# EAGLE design domino-clock-r1 (EAGLE 5.11)
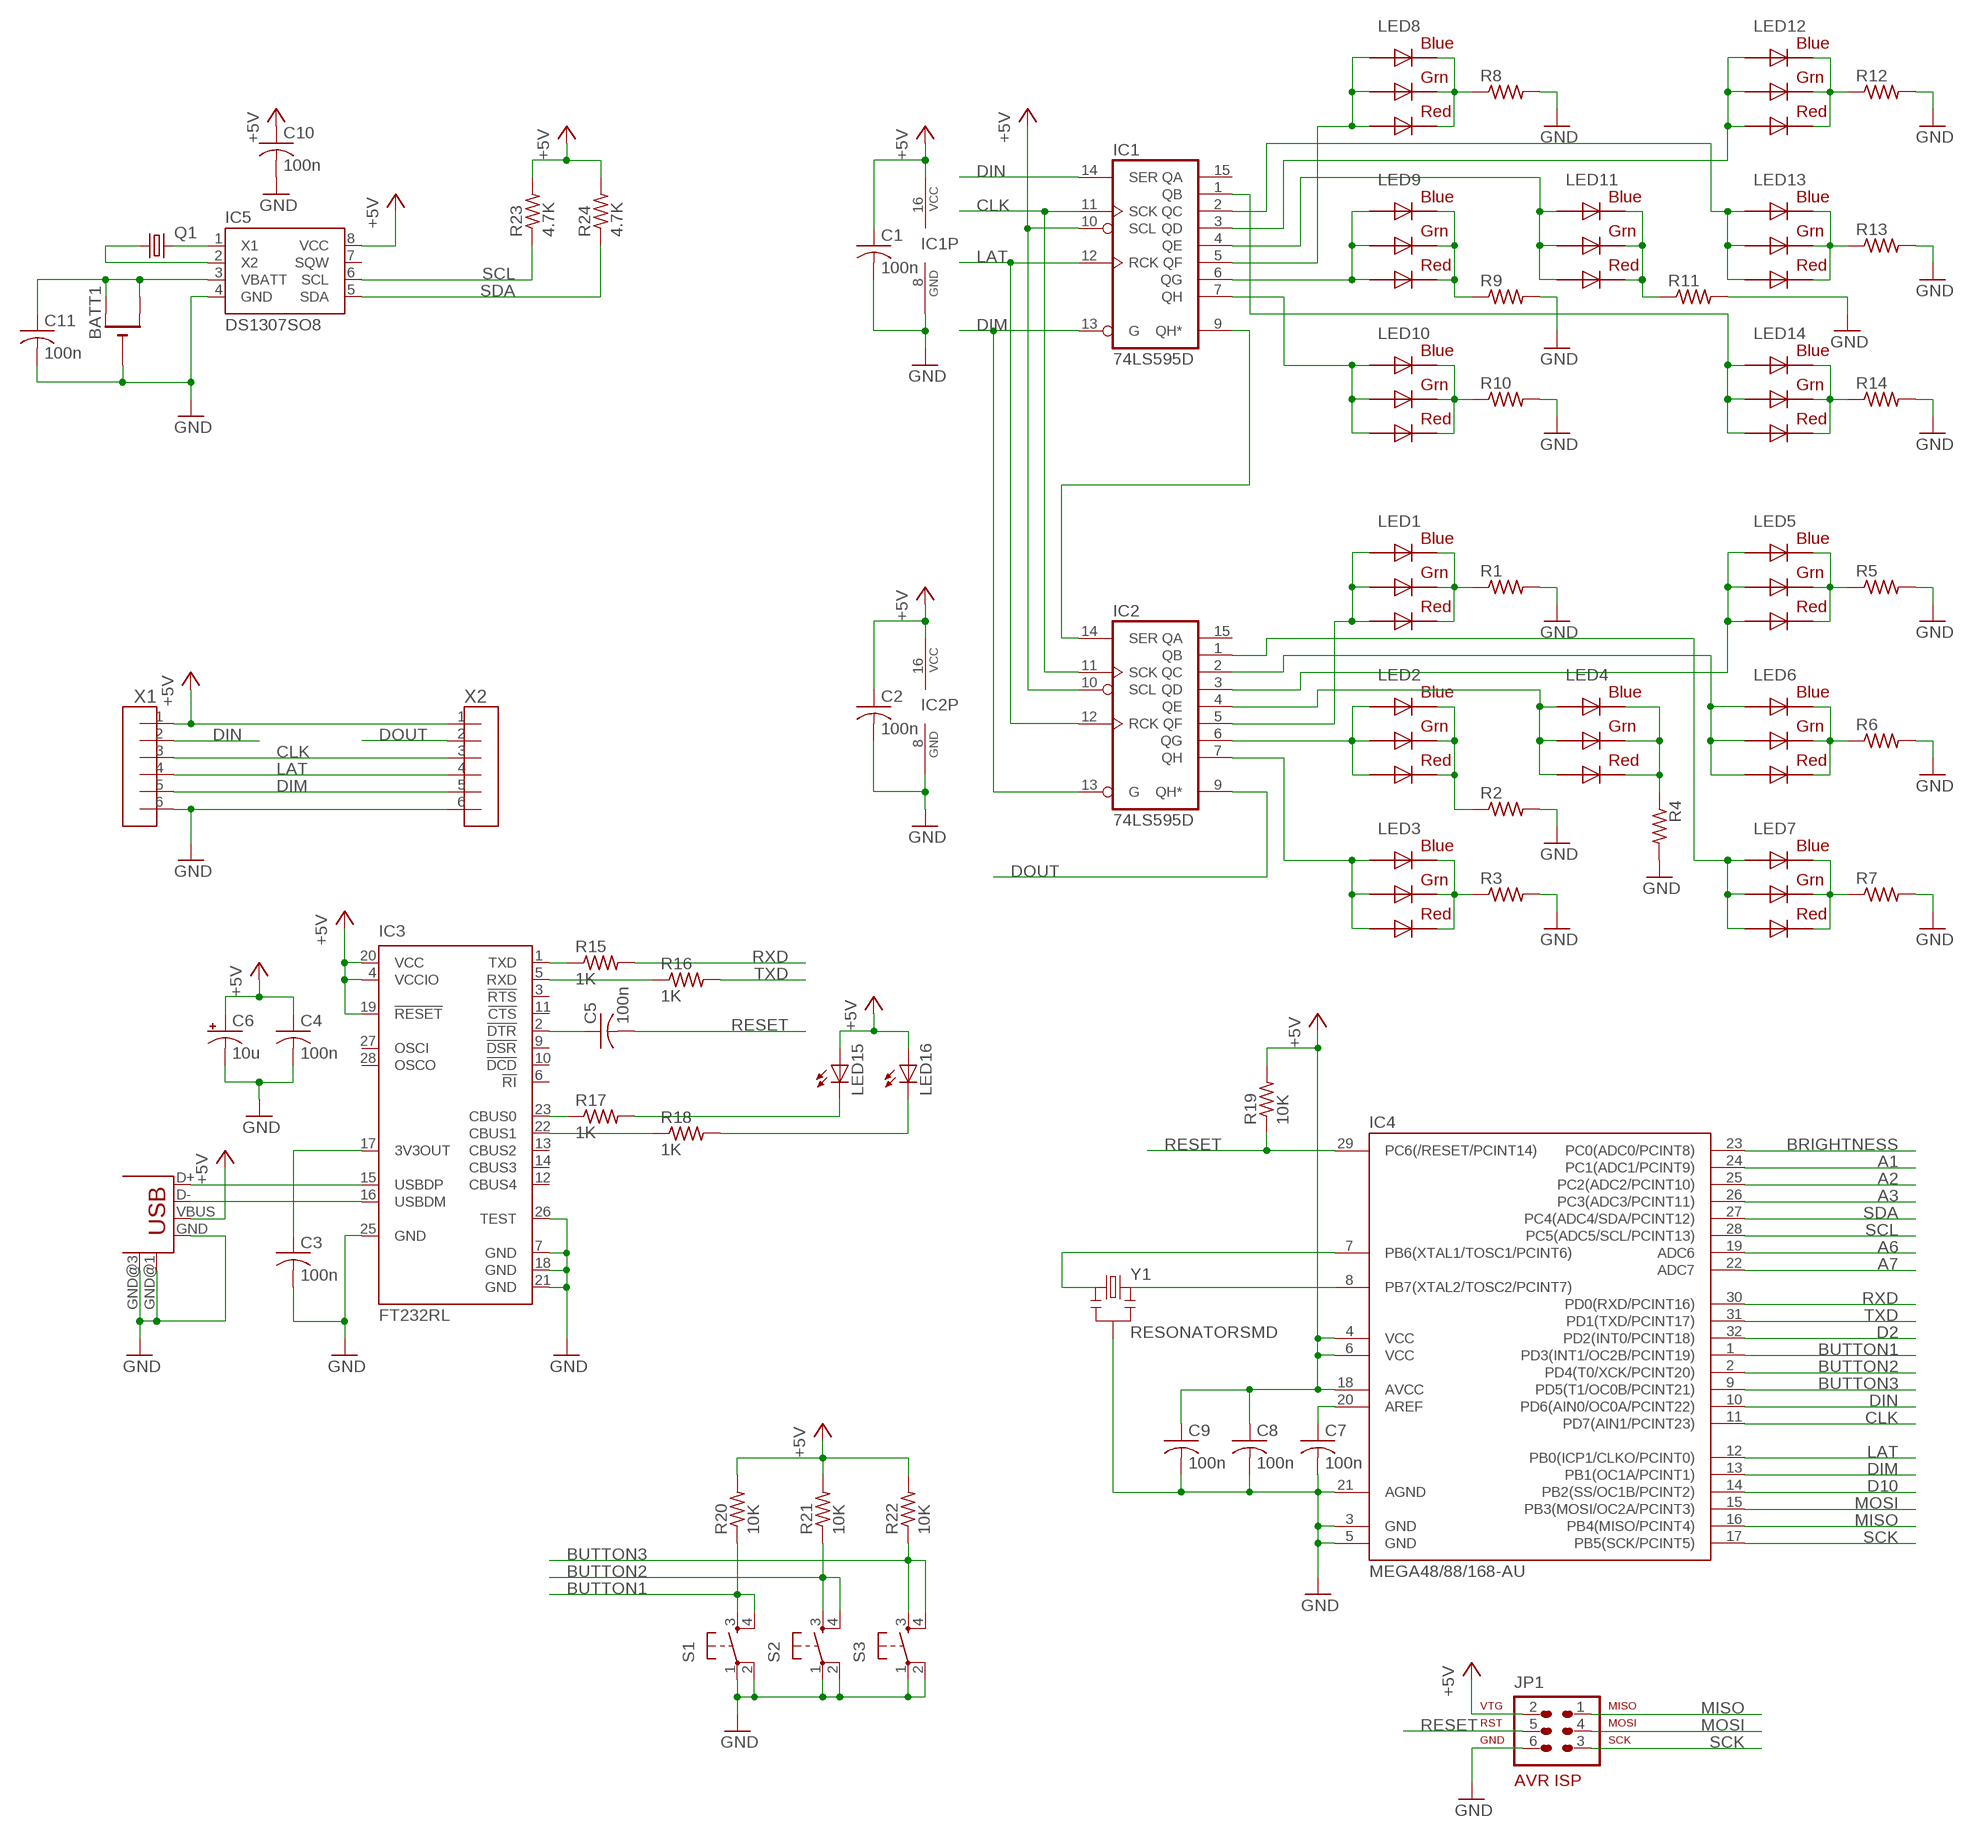
[diagram p0: schematic, sheet 1]

## Parts
BATT1  CR1220SMT  [CR1220-SMD]
C1  100n  C-USC0603  [C0603]
C2  100n  C-USC0603  [C0603]
C3  100n  C-USC0603  [C0603]
C4  100n  C-USC0603  [C0603]
C5  100n  C-USC0603  [C0603]
C6  10u  CPOL-USB  [PANASONIC_B]
C7  100n  C-USC0603  [C0603]
C8  100n  C-USC0603  [C0603]
C9  100n  C-USC0603  [C0603]
C10  100n  C-USC0603  [C0603]
C11  100n  C-USC0603  [C0603]
IC1  74LS595D  [SO16]
IC2  74LS595D  [SO16]
IC3  FT232RL  [SSOP28]
IC4  MEGA48/88/168-AU  [TQFP32-08]
IC5  DS1307SO8  [SO08]
JP1  AVR-ISP-6  [AVR-ISP-6]
LED1  RGBLED5050  [RGBLED5050]
LED2  RGBLED5050  [RGBLED5050]
LED3  RGBLED5050  [RGBLED5050]
LED4  RGBLED5050  [RGBLED5050]
LED5  RGBLED5050  [RGBLED5050]
LED6  RGBLED5050  [RGBLED5050]
LED7  RGBLED5050  [RGBLED5050]
LED8  RGBLED5050  [RGBLED5050]
LED9  RGBLED5050  [RGBLED5050]
LED10  RGBLED5050  [RGBLED5050]
LED11  RGBLED5050  [RGBLED5050]
LED12  RGBLED5050  [RGBLED5050]
LED13  RGBLED5050  [RGBLED5050]
LED14  RGBLED5050  [RGBLED5050]
LED15  LEDCHIP-LED0603  [CHIP-LED0603]
LED16  LEDCHIP-LED0603  [CHIP-LED0603]
Q1  CRYSTALTC38H  [TC38H]
R1  R-US_R0805  [R0805]
R2  R-US_R0805  [R0805]
R3  R-US_R0805  [R0805]
R4  R-US_R0805  [R0805]
R5  R-US_R0805  [R0805]
R6  R-US_R0805  [R0805]
R7  R-US_R0805  [R0805]
R8  R-US_R0805  [R0805]
R9  R-US_R0805  [R0805]
R10  R-US_R0805  [R0805]
R11  R-US_R0805  [R0805]
R12  R-US_R0805  [R0805]
R13  R-US_R0805  [R0805]
R14  R-US_R0805  [R0805]
R15  1K  R-US_R0603  [R0603]
R16  1K  R-US_R0603  [R0603]
R17  1K  R-US_R0603  [R0603]
R18  1K  R-US_R0603  [R0603]
R19  10K  R-US_R0603  [R0603]
R20  10K  R-US_R0603  [R0603]
R21  10K  R-US_R0603  [R0603]
R22  10K  R-US_R0603  [R0603]
R23  4.7K  R-US_R0603  [R0603]
R24  4.7K  R-US_R0603  [R0603]
S1  TAC_SWITCHSMD  [TACTILE_SWITCH_SMD]
S2  TAC_SWITCHSMD  [TACTILE_SWITCH_SMD]
S3  TAC_SWITCHSMD  [TACTILE_SWITCH_SMD]
USB1  USB-RAYMOND  [USB-MB-RAYMOND]
X1  M06-100MIL  [100MIL-6]
X2  M06-100MIL  [100MIL-6]
Y1  RESONATORSMD  [RESONATOR-SMD]

## Nets
+5V: C1.1 C2.1 C4.1 C6.+ C8.1 C9.1 C10.1 IC1.10(SCL) IC1.16(VCC) IC2.10(SCL) IC2.16(VCC) IC3.4(VCCIO) IC3.19(!RESET) IC3.20(VCC) IC4.4(VCC) IC4.6(VCC) IC4.18(AVCC) IC5.8(VCC) JP1.2 LED15.A LED16.A R19.2 R20.2 R21.2 R22.2 R23.2 R24.2 USB1.VBUS X1.1 X2.1
A1: IC4.24(PC1(ADC1/PCINT9))
A2: IC4.25(PC2(ADC2/PCINT10))
A3: IC4.26(PC3(ADC3/PCINT11))
A6: IC4.19(ADC6)
A7: IC4.22(ADC7)
BRIGHTNESS: IC4.23(PC0(ADC0/PCINT8))
BUTTON1: IC4.1(PD3(INT1/OC2B/PCINT19)) R20.1 S1.3 S1.4
BUTTON2: IC4.2(PD4(T0/XCK/PCINT20)) R21.1 S2.3 S2.4
BUTTON3: IC4.9(PD5(T1/OC0B/PCINT21)) R22.1 S3.3 S3.4
CLK: IC1.11(SCK) IC2.11(SCK) IC4.11(PD7(AIN1/PCINT23)) X1.3 X2.3
D2: IC4.32(PD2(INT0/PCINT18))
D10: IC4.14(PB2(SS/OC1B/PCINT2))
DIM: IC1.13(G) IC2.13(G) IC4.13(PB1(OC1A/PCINT1)) X1.5 X2.5
DIN: IC1.14(SER) IC4.10(PD6(AIN0/OC0A/PCINT22)) X1.2
DOUT: IC2.9(QH*) X2.2
GND: BATT1.- C1.2 C2.2 C3.2 C4.2 C6.- C7.2 C8.2 C9.2 C10.2 C11.2 IC1.8(GND) IC2.8(GND) IC3.7(GND) IC3.18(GND) IC3.21(GND) IC3.25(GND) IC3.26(TEST) IC4.3(GND) IC4.5(GND) IC4.21(AGND) IC5.4(GND) JP1.6 R1.2 R2.2 R3.2 R4.2 R5.2 R6.2 R7.2 R8.2 R9.2 R10.2 R11.2 R12.2 R13.2 R14.2 S1.1 S1.2 S2.1 S2.2 S3.1 S3.2 USB1.GND USB1.GND@1(GND) USB1.GND@3(GND) X1.6 X2.6 Y1.2
LAT: IC1.12(RCK) IC2.12(RCK) IC4.12(PB0(ICP1/CLKO/PCINT0)) X1.4 X2.4
MISO: IC4.16(PB4(MISO/PCINT4)) JP1.1
MOSI: IC4.15(PB3(MOSI/OC2A/PCINT3)) JP1.4
N$1: IC1.7(QH) LED10.1(GREEN_A) LED10.2(RED_A) LED10.3(BLUE_A)
N$2: IC1.6(QG) LED9.1(GREEN_A) LED9.2(RED_A) LED9.3(BLUE_A)
N$3: IC1.5(QF) LED8.1(GREEN_A) LED8.2(RED_A) LED8.3(BLUE_A)
N$4: IC1.4(QE) LED11.1(GREEN_A) LED11.2(RED_A) LED11.3(BLUE_A)
N$5: IC1.3(QD) LED12.1(GREEN_A) LED12.2(RED_A) LED12.3(BLUE_A)
N$6: IC1.2(QC) LED13.1(GREEN_A) LED13.2(RED_A) LED13.3(BLUE_A)
N$7: IC1.1(QB) LED14.1(GREEN_A) LED14.2(RED_A) LED14.3(BLUE_A)
N$8: IC1.9(QH*) IC2.14(SER)
N$9: LED1.4(BLUE_C) LED1.5(RED_C) LED1.6(GREEN_C) R1.1
N$10: LED2.4(BLUE_C) LED2.5(RED_C) LED2.6(GREEN_C) R2.1
N$11: LED4.4(BLUE_C) LED4.5(RED_C) LED4.6(GREEN_C) R4.1
N$12: LED3.4(BLUE_C) LED3.5(RED_C) LED3.6(GREEN_C) R3.1
N$13: IC2.7(QH) LED3.1(GREEN_A) LED3.2(RED_A) LED3.3(BLUE_A)
N$14: IC2.6(QG) LED2.1(GREEN_A) LED2.2(RED_A) LED2.3(BLUE_A)
N$15: IC2.5(QF) LED1.1(GREEN_A) LED1.2(RED_A) LED1.3(BLUE_A)
N$16: LED5.4(BLUE_C) LED5.5(RED_C) LED5.6(GREEN_C) R5.1
N$17: IC2.4(QE) LED4.1(GREEN_A) LED4.2(RED_A) LED4.3(BLUE_A)
N$18: LED6.4(BLUE_C) LED6.5(RED_C) LED6.6(GREEN_C) R6.1
N$19: IC2.3(QD) LED5.1(GREEN_A) LED5.2(RED_A) LED5.3(BLUE_A)
N$20: IC2.2(QC) LED6.1(GREEN_A) LED6.2(RED_A) LED6.3(BLUE_A)
N$21: IC2.1(QB) LED7.1(GREEN_A) LED7.2(RED_A) LED7.3(BLUE_A)
N$22: LED7.4(BLUE_C) LED7.5(RED_C) LED7.6(GREEN_C) R7.1
N$23: LED8.4(BLUE_C) LED8.5(RED_C) LED8.6(GREEN_C) R8.1
N$24: LED9.4(BLUE_C) LED9.5(RED_C) LED9.6(GREEN_C) R9.1
N$25: LED10.4(BLUE_C) LED10.5(RED_C) LED10.6(GREEN_C) R10.1
N$26: LED11.4(BLUE_C) LED11.5(RED_C) LED11.6(GREEN_C) R11.1
N$27: LED12.4(BLUE_C) LED12.5(RED_C) LED12.6(GREEN_C) R12.1
N$28: LED13.4(BLUE_C) LED13.5(RED_C) LED13.6(GREEN_C) R13.1
N$29: LED14.4(BLUE_C) LED14.5(RED_C) LED14.6(GREEN_C) R14.1
N$30: IC3.15(USBDP) USB1.D+
N$31: IC3.16(USBDM) USB1.D-
N$32: IC3.23(CBUS0) R17.1
N$33: C3.1 IC3.17(3V3OUT)
N$34: IC3.22(CBUS1) R18.1
N$35: C5.1 IC3.2(!DTR)
N$36: IC3.1(TXD) R15.1
N$37: IC3.5(RXD) R16.1
N$38: LED15.C R17.2
N$39: LED16.C R18.2
N$40: IC4.7(PB6(XTAL1/TOSC1/PCINT6)) Y1.1
N$41: IC4.8(PB7(XTAL2/TOSC2/PCINT7)) Y1.3
N$42: C7.1 IC4.20(AREF)
N$43: IC5.2(X2) Q1.1
N$44: IC5.1(X1) Q1.2
N$46: BATT1.+$1(+) BATT1.+$2(+1) C11.1 IC5.3(VBATT)
RESET: C5.2 IC4.29(PC6(/RESET/PCINT14)) JP1.5 R19.1
RXD: IC4.30(PD0(RXD/PCINT16)) R15.2
SCK: IC4.17(PB5(SCK/PCINT5)) JP1.3
SCL: IC4.28(PC5(ADC5/SCL/PCINT13)) IC5.6(SCL) R23.1
SDA: IC4.27(PC4(ADC4/SDA/PCINT12)) IC5.5(SDA) R24.1
TXD: IC4.31(PD1(TXD/PCINT17)) R16.2
Unconnected: IC1.15(QA) IC2.15(QA) IC3.3(!RTS) IC3.6(!RI) IC3.9(!DSR) IC3.10(!DCD) IC3.11(!CTS) IC3.12(CBUS4) IC3.13(CBUS2) IC3.14(CBUS3) IC3.27(OSCI) IC3.28(OSCO) IC5.7(SQW)

## Library data of the parts
BATT1 = adafruit:CR1220: CR1216/CR1220/CR1225 12mm 3V lithium coin cell Great for battery packup. Both SMT and THM holders. Note the THM package has the ground pads on both sides of the PCB so that the masks are the same - this reduces the cost
C1-C5 C7-C11 = rcl:C-US: CAPACITOR, American symbol
C6 = rcl:CPOL-US: POLARIZED CAPACITOR, American symbol
IC1 IC2 = 74xx-us:74*595: 8-bit SHIFT REGISTER, output latch
IC3 = ftdichip:FT232R: Source: http://www.ftdichip.com/Documents/DataSheets/DS_FT232R_v104.pdf; MPN: FT232RL; OC_FARNELL: 1146032; OC_NEWARK: 91K9918
IC4 = avr-5:MEGA48/88/168
IC5 = SparkFun:DS1307
JP1 = avr-5:AVR-ISP-6: AVR ISP-6 Serial Programming Header
LED1-LED14 = adafruit:RGBLED: For 5050 RGB LEDs, the order of the LEDs may vary from one manufacturer to another!
LED15 LED16 = led:LED: LED OSRAM: - CHIPLED LG R971, LG N971, LY N971, LG Q971, LY Q971, LO R971, LY R971 LH N974, LH R974 LS Q976, LO Q976, LY Q976 LO Q996 - Hyper CHIPLED LW Q18S LB Q993, LB Q99A, LB R99A - SideLED LS A670, LO A670, LY A670, LG A670, LP A670 LB A673, LV A673, LT A673, LW A673 LH A674 LY A675 LS A676, LA A676, LO A676, LY A676, LW A676 LS A679, LY A679, LG A679 - Hyper Micro SIDELED® LS Y876, LA Y876, LO Y876, LY Y876 LT Y87S - SmartLED LW L88C, LW L88S LB L89C, LB L89S, LG L890 LS L89K, LO L89K, LY L89K LS L896, LA L896, LO L896, LY L896 - TOPLED LS T670, LO T670, LY T670, LG T670, LP T670 LSG T670, LSP T670, LSY T670, LOP T670, LYG T670 LG T671, LOG T671, LSG T671 LB T673, LV T673, LT T673, LW T673 LH T674 LS T676, LA T676, LO T676, LY T676, LB T676, LH T676, LSB T676, LW T676 LB T67C, LV T67C, LT T67C, LS T67K, LO T67K, LY T67K, LW E67C LS E67B, LA E67B, LO E67B, LY E67B, LB E67C, LV E67C, LT E67C LW T67C LS T679, LY T679, LG T679 LS T770, LO T770, LY T770, LG T770, LP T770 LB T773, LV T773, LT T773, LW T773 LH T774 LS E675, LA E675, LY E675, LS T675 LS T776, LA T776, LO T776, LY T776, LB T776 LHGB T686 LT T68C, LB T68C - Hyper Mini TOPLED® LB M676 - Mini TOPLED Santana® LG M470 LS M47K, LO M47K, LY M47K Source: http://www.osram.convergy.de LUXEON: - LUMILED® LXK2-PW12-R00, LXK2-PW12-S00, LXK2-PW14-U00, LXK2-PW14-V00 LXK2-PM12-R00, LXK2-PM12-S00, LXK2-PM14-U00 LXK2-PE12-Q00, LXK2-PE12-R00, LXK2-PE12-S00, LXK2-PE14-T00, LXK2-PE14-U00 LXK2-PB12-K00, LXK2-PB12-L00, LXK2-PB12-M00, LXK2-PB14-N00, LXK2-PB14-P00, LXK2-PB14-Q00 LXK2-PR12-L00, LXK2-PR12-M00, LXK2-PR14-Q00, LXK2-PR14-R00 LXK2-PD12-Q00, LXK2-PD12-R00, LXK2-PD12-S00 LXK2-PH12-R00, LXK2-PH12-S00 LXK2-PL12-P00, LXK2-PL12-Q00, LXK2-PL12-R00 Source: www.luxeon.com KINGBRIGHT: KA-3528ASYC Source: www.kingbright.com
Q1 = crystal:CRYSTAL: CRYSTAL; OC_FARNELL: unknown; OC_NEWARK: unknown
R1-R24 = rcl:R-US_: RESISTOR, American symbol
S1-S3 = SparkFun:TAC_SWITCH: Momentary Switch Button commonly used for reset or general input. Spark Fun Electronics SKU : COM-00097
USB1 = con-usb-2:USB: USB Connectors
X1 X2 = rbg-generic-headers:M06-100MIL
Y1 = SparkFun:RESONATOR: Resonator Small SMD resonator. This is the itty bitty 10/20MHz resonators with built in caps. CSTCE10M0G55 and CSTCE20M0V53. Footprint has been reviewed closely but hasn't been tested yet.

## Board
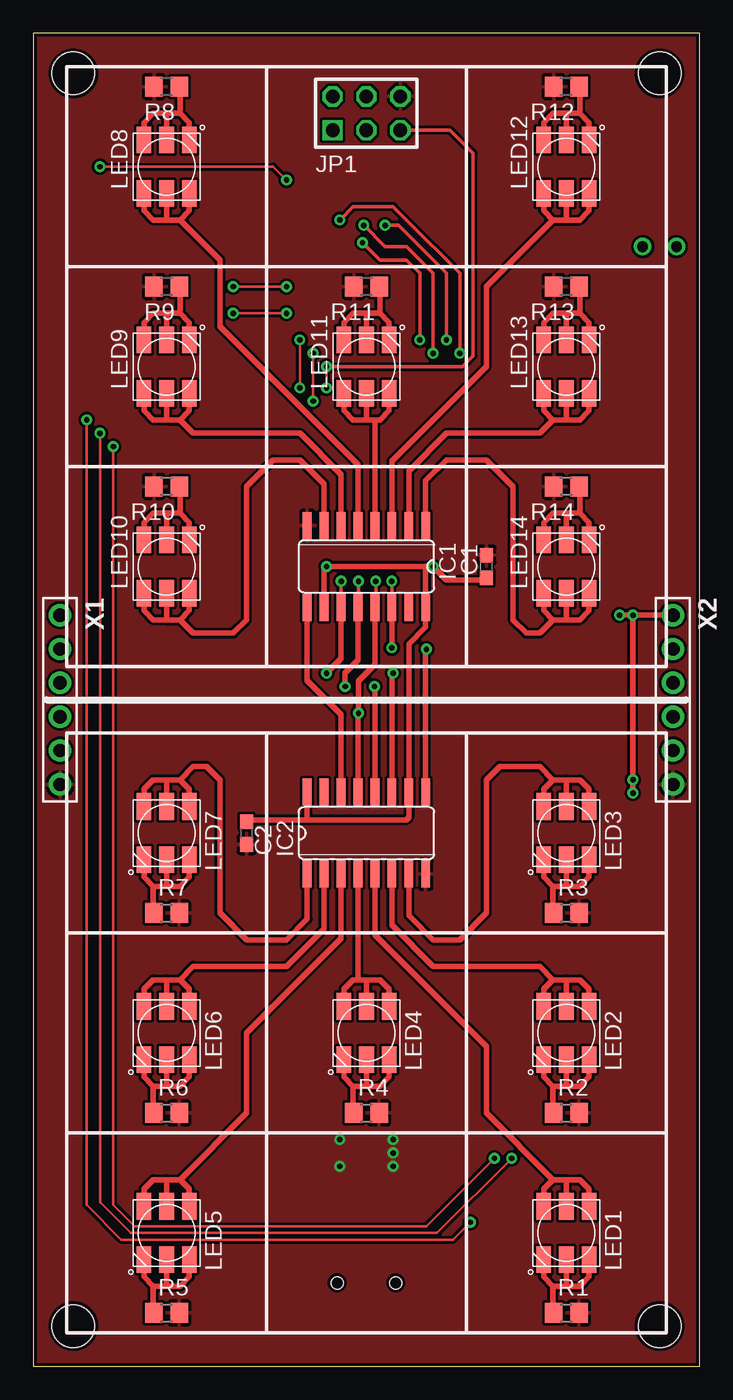
[diagram p1: board, top side]
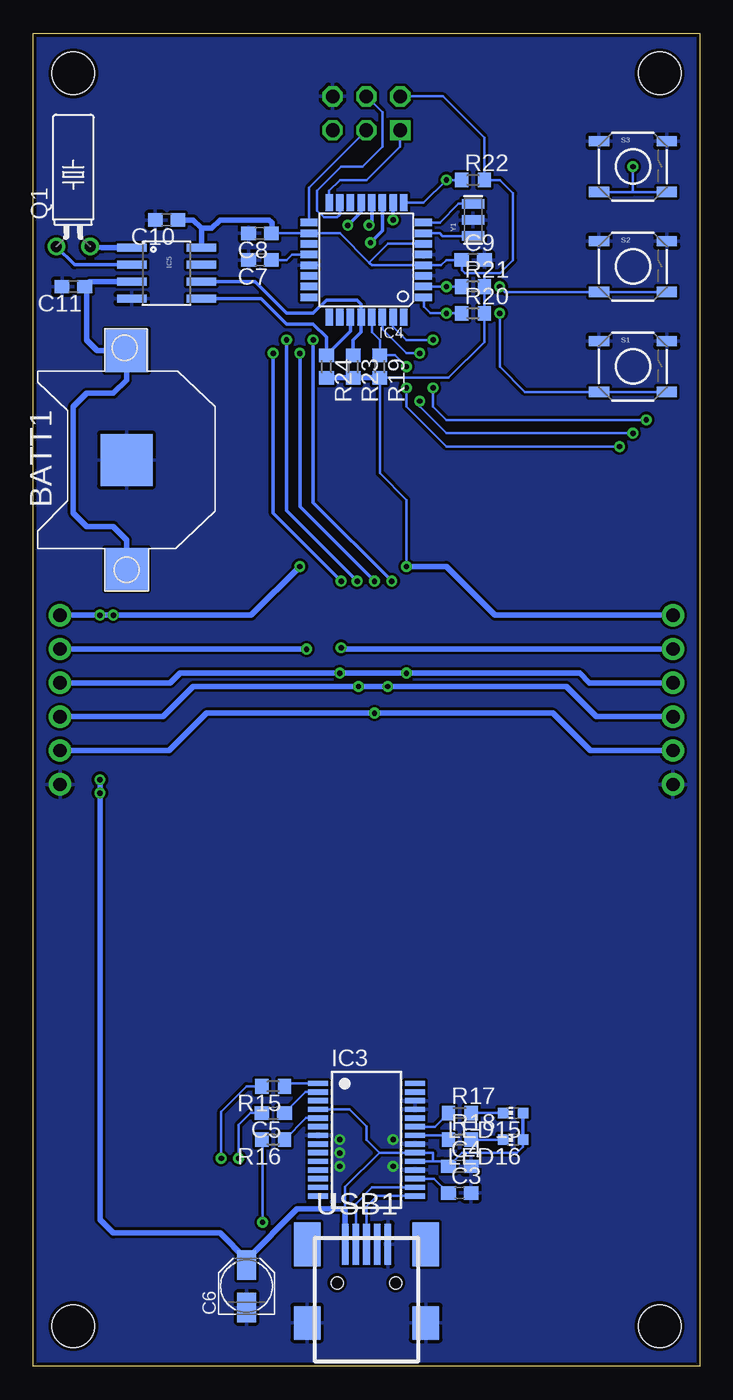
[diagram p2: board, bottom side, seen from below]

Size 50 x 100 mm. Coordinates in mm from the lower left corner, seen from the top.
Outline: 0,0 50,0 50,100 0,100 0,0
Copper layers (1*16): Top 0.035mm / dielectric 1.5mm / Bottom 0.035mm
Design rules "default *": minimum track width 8mil, minimum drill 12mil, track to track 8mil, track to pad 8mil, pad to pad 8mil, via to via 8mil, smd to smd 8mil, copper to edge 10mil, drill to drill 8mil, minimum pad ring 10mil, minimum via ring 8mil, stop-mask expansion 4mil, vias tented up to drill 18mil, thermal gap 10mil
Holes 3.2 mm at 3,97 47,97 47,3 3,3

### Footprints (pad centres in the part's own frame; a part is rotated, then mirrored left to right if it is on the bottom)
CR1220-SMD = smd 3.2 x 3.2: +$1 -8.2,0; +$2 8.2,0 | smd 3.9 x 3.9: - 0,0
C0603 = smd 1.1 x 1: 1 -0.85,0; 2 0.85,0
PANASONIC_B = smd 2.2 x 1.4: + 1.6,0; - -1.6,0
SO16 = smd 0.66 x 2.032: 1 -4.445,-3.073; 2 -3.175,-3.073; 3 -1.905,-3.073; 4 -0.635,-3.073; 5 0.635,-3.073; 6 1.905,-3.073; 7 3.175,-3.073; 8 4.445,-3.073; 9 4.445,3.073; 10 3.175,3.073; 11 1.905,3.073; 12 0.635,3.073; 13 -0.635,3.073; 14 -1.905,3.073; 15 -3.175,3.073; 16 -4.445,3.073
SSOP28 = smd 0.4 x 1.5: 1 -4.225,-3.625; 2 -3.575,-3.625; 3 -2.925,-3.625; 4 -2.275,-3.625; 5 -1.625,-3.625; 6 -0.975,-3.625; 7 -0.325,-3.625; 8 0.325,-3.625; 9 0.975,-3.625; 10 1.625,-3.625; 11 2.275,-3.625; 12 2.925,-3.625; 13 3.575,-3.625; 14 4.225,-3.625; 15 4.225,3.625; 16 3.575,3.625; 17 2.925,3.625; 18 2.275,3.625; 19 1.625,3.625; 20 0.975,3.625; 21 0.325,3.625; 22 -0.325,3.625; 23 -0.975,3.625; 24 -1.625,3.625; 25 -2.275,3.625; 26 -2.925,3.625; 27 -3.575,3.625; 28 -4.225,3.625
TQFP32-08 = smd 1.27 x 0.559: 1 -4.293,2.8; 2 -4.293,2; 3 -4.293,1.2; 4 -4.293,0.4; 5 -4.293,-0.4; 6 -4.293,-1.2; 7 -4.293,-2; 8 -4.293,-2.8; 17 4.293,-2.8; 18 4.293,-2; 19 4.293,-1.2; 20 4.293,-0.4; 21 4.293,0.4; 22 4.293,1.2; 23 4.293,2; 24 4.293,2.8 | smd 0.559 x 1.27: 9 -2.8,-4.293; 10 -2,-4.293; 11 -1.2,-4.293; 12 -0.4,-4.293; 13 0.4,-4.293; 14 1.2,-4.293; 15 2,-4.293; 16 2.8,-4.293; 25 2.8,4.293; 26 2,4.293; 27 1.2,4.293; 28 0.4,4.293; 29 -0.4,4.293; 30 -1.2,4.293; 31 -2,4.293; 32 -2.8,4.293
SO08 = smd 0.61 x 2.21: 1 -1.905,-2.616; 2 -0.635,-2.616; 3 0.635,-2.616; 4 1.905,-2.616; 5 1.905,2.616; 6 0.635,2.616; 7 -0.635,2.616; 8 -1.905,2.616
AVR-ISP-6 = drill 1.016 square: 1 -2.54,-1.27 | drill 1.016 octagon: 2 -2.54,1.27; 3 0,-1.27; 4 0,1.27; 5 2.54,-1.27; 6 2.54,1.27
RGBLED5050 = smd 2 x 1.1: 1 -2,1.7; 2 -2,0; 3 -2,-1.7; 4 2,-1.7; 5 2,0; 6 2,1.7
CHIP-LED0603 = smd 0.8 x 0.8: A 0,-0.75; C 0,0.75
TC38H = drill 0.813 round: 1 -1.27,0; 2 1.27,0
R0805 = smd 1.3 x 1.5: 1 -0.95,0; 2 0.95,0
R0603 = smd 1 x 1.1: 1 -0.85,0; 2 0.85,0
TACTILE_SWITCH_SMD = smd 1.524 x 0.762: 1 -2.54,1.905; 2 2.54,1.905; 3 -2.54,-1.905; 4 2.54,-1.905
USB-MB-RAYMOND = smd 0.5 x 3.1: D+ 0,4.15; D- -0.8,4.15; GND 1.6,4.15; ID 0.8,4.15; VBUS -1.6,4.15 | smd 2 x 2.5: GND@1 -4.45,-1.75; GND@3 4.45,-1.75 | smd 2 x 3.3: GND@2 -4.45,4.15; GND@4 4.45,4.15 | hole 0.9: -2.2,1.25; 2.2,1.25
100MIL-6 = drill 1 pad 1.676 round: 1 -6.35,0; 2 -3.81,0; 3 -1.27,0; 4 1.27,0; 5 3.81,0; 6 6.35,0
RESONATOR-SMD = smd 0.7 x 1.7: 1 -1.2,0; 2 0,0; 3 1.2,0

### Placement (x,y rotation side)
BATT1  43,68 90 bottom
C1  34,60 90 top
C2  16,40 270 top
C3  18,13 0 bottom
C4  18,15 0 bottom
C5  32,19 180 bottom
C6  34,6 90 bottom
C7  33,83 180 bottom
C8  33,85 180 bottom
C9  17,83 0 bottom
C10  40,86 180 bottom
C11  47,81 180 bottom
IC1  25,60 180 top
IC2  25,40 0 top
IC3  25,17 270 bottom
IC4  25,83 180 bottom
IC5  40,82 270 bottom
JP1  25,94 0 top
LED1  40,10 270 top
LED2  40,25 270 top
LED3  40,40 270 top
LED4  25,25 270 top
LED5  10,10 270 top
LED6  10,25 270 top
LED7  10,40 270 top
LED8  10,90 90 top
LED9  10,75 90 top
LED10  10,60 90 top
LED11  25,75 90 top
LED12  40,90 90 top
LED13  40,75 90 top
LED14  40,60 90 top
LED15  14,19 90 bottom
LED16  14,17 90 bottom
Q1  47,84 0 bottom
R1  40,4 0 top
R2  40,19 0 top
R3  40,34 0 top
R4  25,19 0 top
R5  10,4 0 top
R6  10,19 0 top
R7  10,34 0 top
R8  10,96 180 top
R9  10,81 180 top
R10  10,66 180 top
R11  25,81 180 top
R12  40,96 180 top
R13  40,81 180 top
R14  40,66 180 top
R15  32,21 180 bottom
R16  32,17 180 bottom
R17  18,19 0 bottom
R18  18,17 0 bottom
R19  24,75 270 bottom
R20  17,79 0 bottom
R21  17,81 0 bottom
R22  17,89 0 bottom
R23  26,75 270 bottom
R24  28,75 270 bottom
S1  5,75 0 bottom
S2  5,82.5 0 bottom
S3  5,90 0 bottom
USB1  25,5 0 bottom
X1  2,50 270 top
X2  48,50 270 top
Y1  17,86 90 bottom

### Tracks (layer width: path | path; a pad name or v marks a point on that pad's centre or on a via)
+5V  (via drill 0.4)
  Top 0.406: 20.5,41 16.05,41 C2.1 | 20.5,41 28,41 28.18,41.17 IC2.10 28.18,54.17 29.45,55.45 IC1.16 29.45,59.95 29.5,60 | IC2.16 20.55,41.05 20.5,41 | 33.95,59 C1.1 33.85,59 31,59 v30,60 29.5,60 | IC1.10 21.82,59.83 v22,60 29.5,60 | v45,56.35 v45,44 v45,43 | v45,56.35 v44,56.35 | v45,56.35 X2.1
  Bottom 0.203: 19.32,15.38 20,15.38 | 20,15.38 IC3.19 | 20,15.38 20,16 20.02,16.02 IC3.20 24.02,16.02 | 24.02,16.02 25,17 25,18 26.27,19.27 IC3.4 | LED16.A 13.25,16.45 13.7,16 17.85,16 C4.1 | IC4.6 23.4,84.2 24.8,82.8 | 24.8,82.8 24.6,82.6 IC4.4 19.4,82.6 19,83 C9.1 17.85,82.25 17.6,82 16.1,82 | 24.8,82.8 27,85 IC4.18 C8.1 | 26.6,11.8 26.6,13.45 24.02,16.02 | 34,8 C6.+ | 16.1,82 15,82 14,83 14,88 15,89 R22.2 16.15,92.15 19.27,95.27 JP1.2 | 16.1,82 16.15,81.95 R21.2 R20.2 16.15,76.85 18.85,74.15 R19.2 24,67 22,65 v22,60
  Bottom 0.254: C4.1 19.32,15.38 | LED16.A LED15.A
  Bottom 0.406: X1.1 15.35,56.35 19,60 v22,60 | X2.1 33.65,56.35 v30,60 | USB1.VBUS 26.6,11.8 30.2,11.8 34,8 36,10 44,10 45,11 v45,43 v45,44 | 37.38,85.38 IC5.8 | 37.38,85.38 38,86 C10.1 | 37.38,85.38 36.62,85.38 36,86 32.3,86 32.1,85.8 32.1,85.05 C8.1 | R24.2 R23.2 R19.2
BUTTON1  (via drill 0.4)
  Top 0.203: v15,79 v19,79
  Bottom 0.203: S1.4 S1.3 13.1,73.09 15,75 v15,79 | v19,79 R20.1 20.2,79 20.7,79.5 IC4.1
BUTTON2  (via drill 0.4)
  Top 0.203: v15,81 v19,81
  Bottom 0.203: R21.1 v19,81 IC4.2 | S2.4 S2.3 14.6,80.59 v15,81
BUTTON3  (via drill 0.4)
  Top 0.203: v5,90 18,90 v19,89
  Bottom 0.203: IC4.9 20.71,87.29 v19,89 R22.1 | S3.4 S3.3 5,88.09 5,88.1 v5,90
CLK  (via drill 0.4)
  Top 0.254: v24.7,84.3 26,83 28,83 29,82 v29,77 | v23.1,58.9 IC1.11
  Top 0.406: IC1.11 23.09,53.09 v22,52 | IC2.11 26.91,51.91 v27,52
  Bottom 0.254: IC4.11 23.8,85.2 v24.7,84.3 | v29,77 29,64.8 v23.1,58.9
  Bottom 0.406: X1.3 8.27,51.27 9,52 v22,52 v27,52 39,52 39.73,51.27 X2.3
DIM  (via drill 0.4)
  Top 0.254: v26.4,85.6 27.4,85.6 31,82 v31,77 | v25.7,58.9 25.7,56.99 IC1.13
  Top 0.406: IC2.13 24.36,48.97 v24.4,49 24.4,51.4 25.64,52.63 IC1.13
  Bottom 0.254: IC4.13 25.4,86.6 v26.4,85.6 | v31,77 31,64.2 v25.7,58.9
  Bottom 0.406: X1.5 8.19,46.19 11,49 v24.4,49 37,49 39.81,46.19 X2.5
DIN  (via drill 0.4)
  Top 0.254: v23,86 24,87 27,87 28,86 32,82 v32,76 | v26.9,58.9 IC1.14
  Top 0.406: v26.9,53.9 IC1.14
  Bottom 0.254: v23,86 IC4.10 | v32,76 32,64 v26.9,58.9
  Bottom 0.406: X1.2 26.81,53.81 v26.9,53.9
DOUT  (via drill 0.4)
  Top 0.406: IC2.9 29.45,53.74 v29.5,53.8
  Bottom 0.406: v29.5,53.8 X2.2
GND  (via drill 0.4)
  other vias: 27,17 27,16 27,15 23,17 23,15
  pour Top: -1,-1 51,-1 51,101 -1,101
  pour Bottom: -1,-1 51,-1 51,101 -1,101
LAT  (via drill 0.4)
  Top 0.254: v24.8,85.6 26.4,84 28,84 30,82 v30,76 | v24.4,58.9 24.4,56.96 IC1.12
  Top 0.406: IC2.12 25.64,50.97 v25.6,51 | IC1.12 24.36,52.97 23.4,52 v23.4,51
  Bottom 0.254: IC4.12 24.6,85.8 v24.8,85.6 | v30,76 30,64.5 v24.4,58.9
  Bottom 0.406: X1.4 7.73,48.73 10,51 v23.4,51 v25.6,51 38,51 40.27,48.73 X2.4
MISO
  Bottom 0.203: IC4.16 27.8,88.2 27,89 25,89 22.5,91.5 22.5,92.69 JP1.1
MOSI
  Bottom 0.203: IC4.15 27,86.4 27.2,86.2 28.2,86.2 28.7,86.7 28.7,88.2 26.9,90 25.3,90 23.8,91.5 23.8,94.07 JP1.4
N$1
  Top 0.406: LED10.1 8.3,56.7 9,56 10,56 | LED10.2 10,56 | LED10.3 11.7,56.7 11,56 | 10,56 11,56 | IC1.7 21.82,66.17 20,68 18,68 16,66 16,56 15,55 12,55 11,56
N$2
  Top 0.406: LED9.1 8.3,71.7 9,71 10,71 | 10,71 LED9.2 | LED9.3 11.7,71.7 11,71 | 10,71 11,71 | IC1.6 23.09,66.91 20,70 12,70 11,71
N$3
  Top 0.406: LED8.1 8.3,86.7 9,86 10,86 | 10,86 LED8.2 | LED8.3 11.7,86.7 11,86 | 11,86 10,86 | IC1.5 24.36,67.64 14,78 14,83 11,86
N$4
  Top 0.406: LED11.1 23.3,71.7 24,71 25,71 | 25,71 LED11.2 | LED11.3 26.7,71.7 26,71 25.6,71 | 25.6,71 25,71 | IC1.4 25.64,70.97 25.6,71
N$5
  Top 0.406: LED12.1 38.3,86.7 39,86 | 39,86 40,86 | 40,86 LED12.2 | LED12.3 41.7,86.7 41,86 40,86 | IC1.3 26.91,67.91 34,75 34,81 39,86
N$6
  Top 0.406: LED13.1 38.3,71.7 39,71 | 39,71 40,71 | 40,71 LED13.2 | LED13.3 41.7,71.7 41,71 40,71 | IC1.2 28.18,67.17 31,70 38,70 39,71
N$7
  Top 0.406: LED14.1 38.3,56.7 39,56 | 39,56 40,56 | 40,56 LED14.2 | LED14.3 41.7,56.7 41,56 40,56 | IC1.1 29.45,66.44 31,68 34,68 36,66 36,56 37,55 38,55 39,56
N$8
  Top 0.406: IC2.14 23.09,48.91 20.55,51.45 IC1.9
N$9
  Top 0.406: LED1.4 38.3,6.7 39,6 | 39,6 39,4.05 R1.1 | 40,6 LED1.5 | 39,6 40,6 | LED1.6 41.7,6.7 41,6 40,6
N$10
  Top 0.406: LED2.4 38.3,21.7 39,21 | 39,21 39,19.05 R2.1 | 40,21 LED2.5 | 39,21 40,21 | LED2.6 41.7,21.7 41,21 40,21
N$11
  Top 0.406: LED4.4 23.3,21.7 24,21 | 24,21 24,19.05 R4.1 | 25,21 LED4.5 | 24,21 25,21 | LED4.6 26.7,21.7 26,21 25,21
N$12
  Top 0.406: LED3.4 38.3,36.7 39,36 | 39,36 39,34.05 R3.1 | 40,36 LED3.5 | 39,36 40,36 | LED3.6 41.7,36.7 41,36 40,36
N$13
  Top 0.406: LED3.1 41.7,43.3 41,44 40,44 | 40,44 LED3.2 | LED3.3 38.3,43.3 39,44 | 39,44 40,44 | IC2.7 28.18,33.83 30,32 32,32 34,34 34,44 35,45 38,45 39,44
N$14
  Top 0.406: LED2.3 38.3,28.3 39,29 | 39,29 40,29 | 40,29 LED2.2 | LED2.1 41.7,28.3 41,29 40,29 | IC2.6 26.91,33.09 30,30 38,30 39,29
N$15
  Top 0.406: LED1.3 38.3,13.3 39,14 | 40,14 39,14 | LED1.2 40,14 | LED1.1 41.7,13.3 41,14 40,14 | IC2.5 25.64,32.37 34,24 34,19 39,14
N$16
  Top 0.406: LED5.4 8.3,6.7 9,6 | 9,6 9,4.05 R5.1 | 10,6 LED5.5 | 9,6 10,6 | LED5.6 11.7,6.7 11,6 10,6
N$17
  Top 0.406: LED4.1 26.7,28.3 26,29 25,29 | 25,29 LED4.2 | LED4.3 23.3,28.3 24,29 24.4,29 | 24.4,29 25,29 | IC2.4 24.36,29.04 24.4,29
N$18
  Top 0.406: LED6.4 8.3,21.7 9,21 | 9,21 9,19.05 R6.1 | 10,21 LED6.5 | 9,21 10,21 | LED6.6 11.7,21.7 11,21 10,21
N$19
  Top 0.406: LED5.3 8.3,13.3 9,14 10,14 | 10,14 LED5.2 | LED5.1 11.7,13.3 11,14 | 10,14 11,14 | IC2.3 23.09,32.09 16,25 16,19 11,14
N$20
  Top 0.406: LED6.1 11.7,28.3 11,29 | 10,29 11,29 | 10,29 LED6.2 | LED6.3 8.3,28.3 9,29 10,29 | IC2.2 21.82,32.83 19,30 12,30 11,29
N$21
  Top 0.406: LED7.3 8.3,43.3 9,44 10,44 | 10,44 LED7.2 | LED7.1 11.7,43.3 11,44 | 11,44 10,44 | IC2.1 20.55,33.55 19,32 16,32 14,34 14,44 13,45 12,45 11,44
N$22
  Top 0.406: LED7.4 8.3,36.7 9,36 | 9,36 9,34.05 R7.1 | 10,36 LED7.5 | 9,36 10,36 | LED7.6 11.7,36.7 11,36 10,36
N$23
  Top 0.406: LED8.6 8.3,93.3 9,94 10,94 | 10,94 LED8.5 | LED8.4 11.7,93.3 11,94 | 11,94 11,95.95 R8.1 | 10,94 11,94
N$24
  Top 0.406: LED9.4 11.7,78.3 11,79 | 11,79 11,80.95 R9.1 | LED9.6 8.3,78.3 9,79 10,79 | 10,79 11,79 | 10,79 LED9.5
N$25
  Top 0.406: LED10.4 11.7,63.3 11,64 | 11,64 11,65.95 R10.1 | LED10.6 8.3,63.3 9,64 10,64 | 10,64 11,64 | 10,64 LED10.5
N$26
  Top 0.406: LED11.4 26.7,78.3 26,79 | 26,79 26,80.95 R11.1 | LED11.6 23.3,78.3 24,79 25,79 | 25,79 26,79 | 25,79 LED11.5
N$27
  Top 0.406: LED12.4 41.7,93.3 41,94 | 41,94 41,95.95 R12.1 | LED12.6 38.3,93.3 39,94 40,94 | 40,94 41,94 | 40,94 LED12.5
N$28
  Top 0.406: LED13.4 41.7,78.3 41,79 | 41,79 41,80.95 R13.1 | LED13.6 38.3,78.3 39,79 40,79 | 40,79 41,79 | 40,79 LED13.5
N$29
  Top 0.406: LED14.4 41.7,63.3 41,64 | 41,64 41,65.95 R14.1 | LED14.6 38.3,63.3 39,64 40,64 | 40,64 41,64 | 40,64 LED14.5
N$30
  Bottom 0.203: IC3.15 24.23,12.78 25,12 USB1.D+
N$31
  Bottom 0.203: USB1.D- 25.8,12.2 24.57,13.43 IC3.16
N$32
  Bottom 0.203: IC3.23 19.88,17.98 R17.1
N$33
  Bottom 0.203: IC3.17 19.93,14.07 C3.1
N$34
  Bottom 0.203: IC3.22 19.27,17.32 R18.1
N$35
  Bottom 0.203: IC3.2 29.57,20.57 C5.1
N$36
  Bottom 0.203: IC3.1 30.82,21.23 R15.1
N$37
  Bottom 0.203: IC3.5 29.52,18.62 R16.1
N$38
  Bottom 0.203: LED15.C R17.2
N$39
  Bottom 0.203: LED16.C R18.2
N$40
  Bottom 0.203: Y1.1 19.3,84.8 19.5,85 IC4.7
N$41
  Bottom 0.203: Y1.3 18.1,87.2 19.5,85.8 IC4.8
N$42
  Bottom 0.203: IC4.20 30.6,83.4 31,83 C7.1
N$43
  Bottom 0.254: IC5.2 46.91,82.64 Q1.1
N$44
  Bottom 0.406: IC5.1 44.83,83.91 Q1.2
N$46
  Bottom 0.406: IC5.3 45.78,81.36 C11.1 46,80.85 46,77 45.2,76.2 BATT1.+$2 43,74 44,73 46,73 47,72 47,64 46,63 44,63 43,62 BATT1.+$1
RESET  (via drill 0.4)
  Top 0.203: v22,73.4 v22,75 | v6,69 6,12.1 7.6,10.5 29.5,10.5 v34.6,15.6
  Top 0.254: JP1.5 31.27,92.73 33,91 33,75.8 32.2,75 v22,75
  Bottom 0.203: IC4.29 24.6,77.6 24,77 R19.1 22.85,75.85 v22,75 | v22,73.4 22,72 19,69 v6,69 | v34.6,15.6 34.6,18.1 33.7,19 C5.2
RXD  (via drill 0.4)
  Top 0.203: v21,72.4 v21,76 | v5,70 5,12.3 7.3,10 30.3,10 v35.9,15.6
  Bottom 0.203: IC4.30 23.8,77.8 22,76 v21,76 | v21,72.4 21,72 19,70 v5,70 | R15.2 34,21 35.9,19.1 v35.9,15.6
SCK
  Bottom 0.203: IC4.17 29.29,88.44 JP1.3
SCL
  Bottom 0.254: R23.1 26,77 25.4,77.6 IC4.28 25.4,79.7 25.7,80 28,80 29,79 31,79 33.37,81.36 IC5.6
SDA
  Bottom 0.254: IC4.27 26.2,77.65 R24.1 28,77.2 29,78.2 31,78.2 32.9,80.09 IC5.5
TXD  (via drill 0.4)
  Top 0.203: v20,73.4 v20,77 | v4,71 4,12.1 6.6,9.5 31.5,9.5 v32.8,10.8
  Bottom 0.203: IC4.31 23,78 22,77 v20,77 | v20,73.4 20,72 19,71 v4,71 | v32.8,10.8 32.8,16.95 R16.2